# Altium schematic sheet USB_PCIE.SchDoc: Network Module
size 431 x 279 mm; DrawnBy: Bin Xiao; Organization: RYSE Inc.
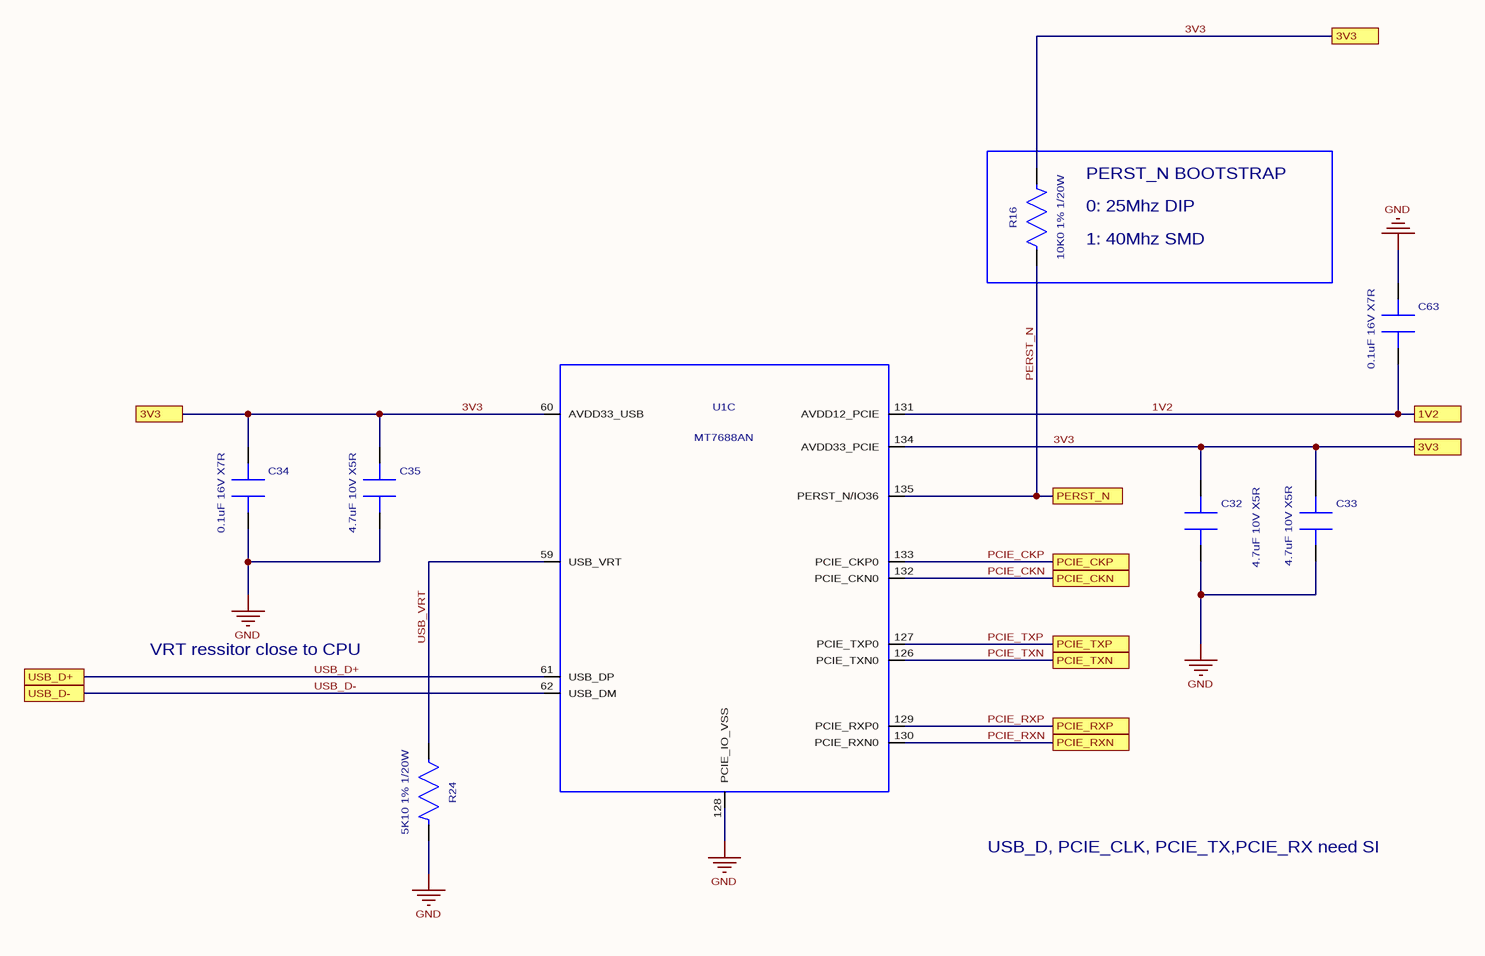
[diagram p0: USB_PCIE.SchDoc]

## Parts
C32  value 4.7uF 10V X5R  [RC0402]  (hidden comment: CAP0402-475-10V-X5R)
C33  value 4.7uF 10V X5R  [RC0402]  (hidden comment: CAP0402-475-10V-X5R)
C34  value 0.1uF 16V X7R  [RC0201]  (hidden comment: CAP0201-104-16V-X7R)
C35  value 4.7uF 10V X5R  [RC0402]  (hidden comment: CAP0402-475-10V-X5R)
C63  value 0.1uF 16V X7R  [RC0201]  (hidden comment: CAP0201-104-16V-X7R)
R16  value 10K0 1% 1/20W  [RC0201]  (hidden comment: RES0201-10K0)
R24  value 5K10 1% 1/20W  [RC0201]  (hidden comment: RES0201-5K10)
U1  MT7688AN  [DR-QFN-128]  (part C of 6)

## Ports
1V2, 3V3, PCIE_CKN, PCIE_CKP, PCIE_RXN, PCIE_RXP, PCIE_TXN, PCIE_TXP, PERST_N, USB_D+, USB_D-

## Nets
GND: C32.2 C33.2 C34.2 C35.2 C63.1 R24.2 U1.128(PCIE_IO_VSS)
1V2: C63.2 U1.131(AVDD12_PCIE) ; port 1V2
3V3: C32.1 C33.1 C34.1 C35.1 R16.2 U1.60(AVDD33_USB) U1.134(AVDD33_PCIE) ; port 3V3
PCIE_CKN: U1.132(PCIE_CKN0) ; port PCIE_CKN
PCIE_CKP: U1.133(PCIE_CKP0) ; port PCIE_CKP
PCIE_RXN: U1.130(PCIE_RXN0) ; port PCIE_RXN
PCIE_RXP: U1.129(PCIE_RXP0) ; port PCIE_RXP
PCIE_TXN: U1.126(PCIE_TXN0) ; port PCIE_TXN
PCIE_TXP: U1.127(PCIE_TXP0) ; port PCIE_TXP
PERST_N: R16.1 U1.135(PERST_N/IO36) ; port PERST_N
USB_D+: U1.61(USB_DP) ; port USB_D+
USB_D-: U1.62(USB_DM) ; port USB_D-
USB_VRT: R24.1 U1.59(USB_VRT)

## Notes on the sheet
- (near R16) PERST_N BOOTSTRAP
- (near R16) 0: 25Mhz DIP
- (near R16) 1: 40Mhz SMD
- VRT ressitor close to CPU
- USB_D, PCIE_CLK, PCIE_TX,PCIE_RX need SI

## Library data of the parts
C32 C33 C35 = CAP0402-475-10V-X5R: CAP CER 4.7UF 10V X5R 0402; Part Number: CL05A475MP5NRNC; Manufacturer: Samsung Electro-Mechanics; Prefered Vender: Digikey; Aligni Value: 4.7u; Type: Capacitor; Geometry.Height: 0.33mm; Revision: A; PCB DECAL: RC0402
C34 C63 = CAP0201-104-16V-X7R: CAP CER 0.1UF 16V X7R 0201; Part Number: GRM033Z71C104KE14D; Manufacturer: Murata Electronics; Prefered Vender: Digikey; Aligni Value: 0.1u; Type: Capacitor; Geometry.Height: 0.33mm; Revision: A; PCB DECAL: RC0201
R16 = RES0201-10K0: RES SMD 10K OHM 1% 1/20W 0201; Manufacturer: Yageo; Part Number: RC0201FR-0710KP; Geometry.Height: 0.5mm; Prefered Vender: Digikey; Type: Resistor; Revision: A; Aligni Value: 10k; PCB DECAL: RC0201
R24 = RES0201-5K10: RES SMD 5.1K OHM 1% 1/20W 0201; Part Number: AC0201FR-075K1L; Manufacturer: YAGEO; Prefered Vender: Digikey; Geometry.Height: 0.6mm; Aligni Value: 5.1k; Revision: A; Type: Resistor; PCB DECAL: RC0201
U1 = MT7688AN: 580Mhz 32bits Networking Processor; Manufacturer: MediaTek Inc; Geometry.Height: 0mm; Type: IC; Part Number: MT7688AN; PCB DECAL: DR-QFN-128